# EAGLE schematic PlantController (EAGLE 6.4)

## Sheet 1 of 2
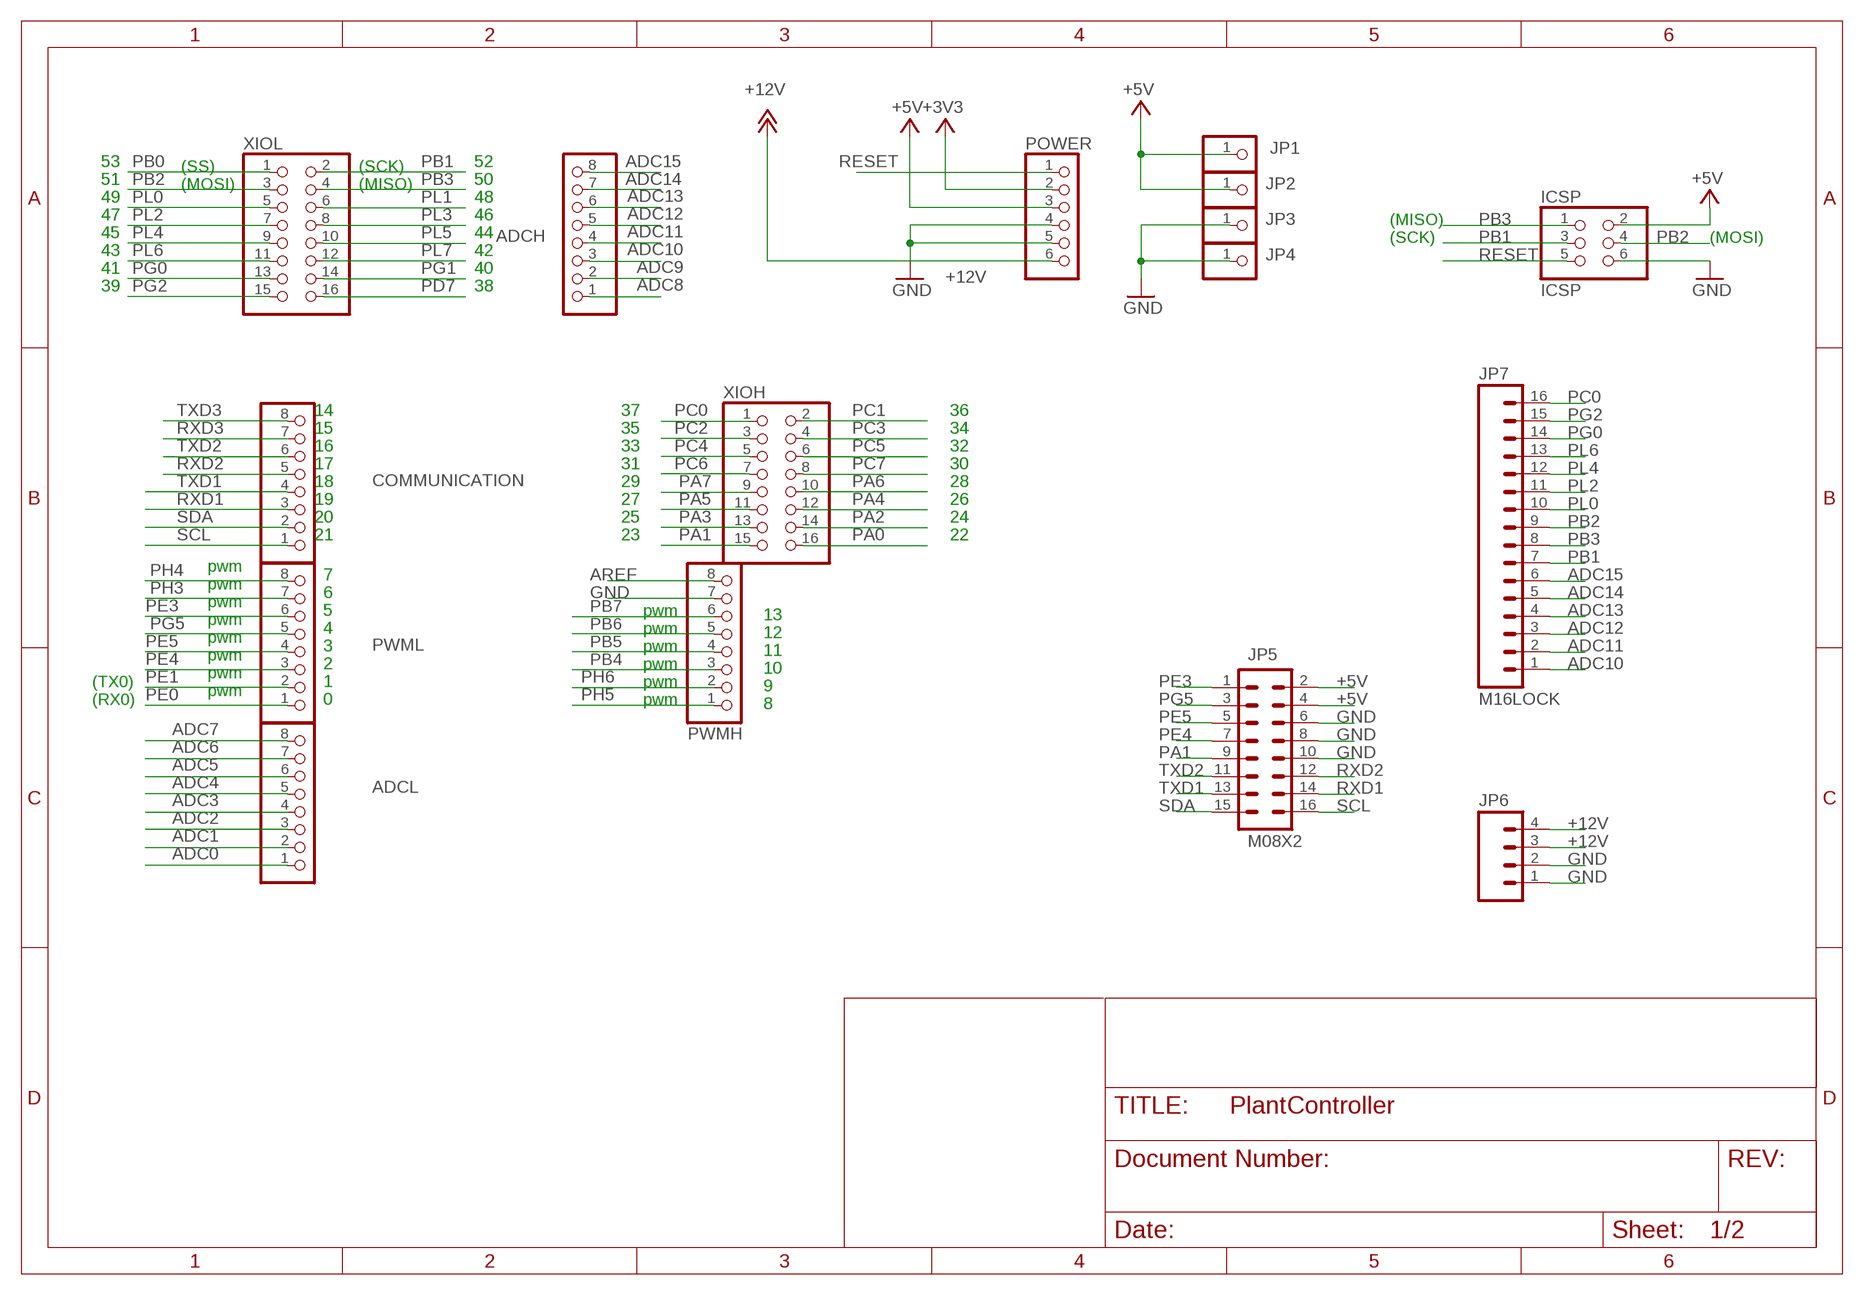
[diagram p0: schematic, sheet 1]

### Parts
ADCH  PINHD-1X8  [1X08]
ADCL  PINHD-1X8  [1X08]
COMMUNICATION  PINHD-1X8  [1X08]
ICSP  ICSP  PINHD-2X3  [2X03]
JP1  PINHD-1X1  [1X01]
JP2  PINHD-1X1  [1X01]
JP3  PINHD-1X1  [1X01]
JP4  PINHD-1X1  [1X01]
JP5  M08X2  [2X8]
JP6  M04LONGPADS  [1X04_LONGPADS]
JP7  M16LOCK  [1X16_LOCK]
POWER  PINHD-1X6  [1X06]
PWMH  PINHD-1X8  [1X08]
PWML  PINHD-1X8  [1X08]
XIOH  PINHD-2X8  [2X08]
XIOL  PINHD-2X8  [2X08]

### Nets
+3V3: POWER.2
+5V: ICSP.2 JP1.1 JP2.1 JP5.2 JP5.4 POWER.3
+12V: JP6.3 JP6.4 POWER.6 ; also sheet 2
ADC0: ADCL.1
ADC1: ADCL.2
ADC2: ADCL.3
ADC3: ADCL.4
ADC4: ADCL.5
ADC5: ADCL.6
ADC6: ADCL.7
ADC7: ADCL.8
ADC8: ADCH.1
ADC9: ADCH.2
ADC10: ADCH.3 JP7.1
ADC11: ADCH.4 JP7.2
ADC12: ADCH.5 JP7.3
ADC13: ADCH.6 JP7.4
ADC14: ADCH.7 JP7.5
ADC15: ADCH.8 JP7.6
AREF: PWMH.8
GND: ICSP.6 JP3.1 JP4.1 JP5.6 JP5.8 JP5.10 JP6.1 JP6.2 POWER.4 POWER.5 PWMH.7 ; also sheet 2
PA0: XIOH.16
PA1: JP5.9 XIOH.15
PA2: XIOH.14
PA3: XIOH.13
PA4: XIOH.12
PA5: XIOH.11
PA6: XIOH.10
PA7: XIOH.9
PB0: XIOL.1
PB1: ICSP.3 JP7.7 XIOL.2
PB2: ICSP.4 JP7.9 XIOL.3
PB3: ICSP.1 JP7.8 XIOL.4
PB4: PWMH.3
PB5: PWMH.4
PB6: PWMH.5
PB7: PWMH.6
PC0: JP7.16 XIOH.1
PC1: XIOH.2
PC2: XIOH.3
PC3: XIOH.4
PC4: XIOH.5
PC5: XIOH.6
PC6: XIOH.7
PC7: XIOH.8
PD7: XIOL.16
PE0: PWML.1
PE1: PWML.2
PE3: JP5.1 PWML.6
PE4: JP5.7 PWML.3
PE5: JP5.5 PWML.4
PG0: JP7.14 XIOL.13
PG1: XIOL.14
PG2: JP7.15 XIOL.15
PG5: JP5.3 PWML.5
PH3: PWML.7
PH4: PWML.8
PH5: PWMH.1
PH6: PWMH.2
PL0: JP7.10 XIOL.5
PL1: XIOL.6
PL2: JP7.11 XIOL.7
PL3: XIOL.8
PL4: JP7.12 XIOL.9
PL5: XIOL.10
PL6: JP7.13 XIOL.11
PL7: XIOL.12
RESET: ICSP.5 POWER.1
RXD1: COMMUNICATION.3 JP5.14
RXD2: COMMUNICATION.5 JP5.12
RXD3: COMMUNICATION.7
SCL: COMMUNICATION.1 JP5.16
SDA: COMMUNICATION.2 JP5.15
TXD1: COMMUNICATION.4 JP5.13
TXD2: COMMUNICATION.6 JP5.11
TXD3: COMMUNICATION.8

### Notes on the sheet
- 53 | (SS) | (SCK) | 52
- 51 | (MOSI) | (MISO) | 50
- 49 | 48
- 47 | 46 | (MISO)
- 45 | 44 | (SCK) | (MOSI)
- 43 | 42
- 41 | 40
- 39 | 38
- 14 | 37 | 36
- 15 | 35 | 34
- 16 | 33 | 32
- 17 | 31 | 30
- 18 | 29 | 28
- 19 | 27 | 26
- 20 | 25 | 24
- 21 | 23 | 22
- pwm
- 7
- pwm
- 6
- pwm
- 5 | pwm | 13
- pwm
- 4 | pwm | 12
- pwm
- 3 | pwm | 11
- pwm
- 2 | pwm | 10
- pwm
- (TX0) | 1 | pwm | 9
- pwm
- (RX0) | 0 | pwm | 8

## Sheet 2 of 2
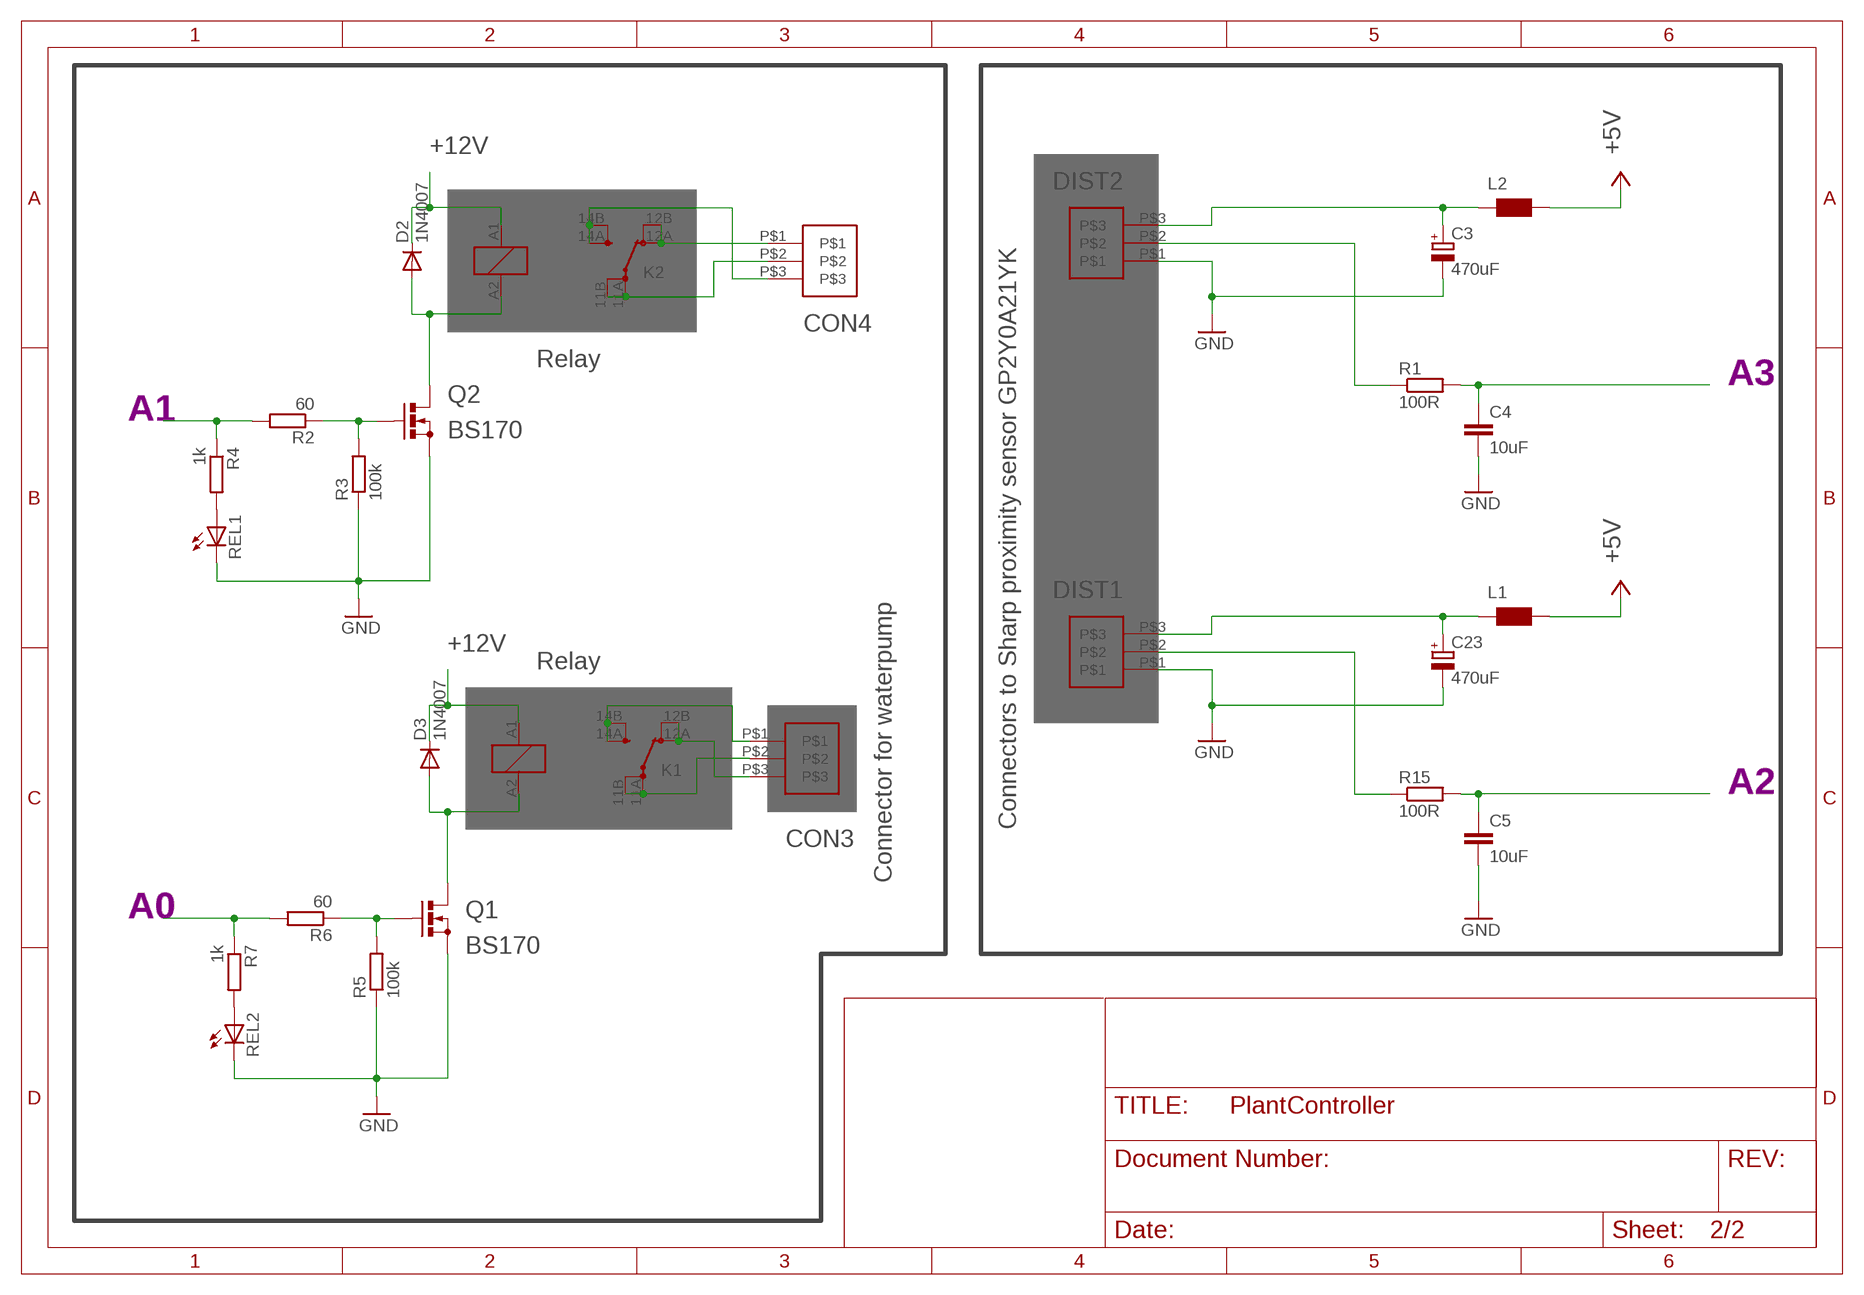
[diagram p1: schematic, sheet 2]

### Parts
C3  470uF  CPOL-EUF  [PANASONIC_F]
C4  10uF  C-EUC0805K  [C0805K]
C5  10uF  C-EUC0805K  [C0805K]
C23  470uF  CPOL-EUF  [PANASONIC_F]
CON3  IMO_20.155MV/3  [IMO_20.155MV/3]
CON4  IMO_20.155MV/3  [IMO_20.155MV/3]
D2  1N4007  1N4004  [DO41-10]
D3  1N4007  1N4004  [DO41-10]
DIST1  IMO_20.155MV/3  [IMO_20.155MV/3]
DIST2  IMO_20.155MV/3  [IMO_20.155MV/3]
K1  RT314005  [RT-C/O16A5]
K2  RT314005  [RT-C/O16A5]
L1  WE-KI_0805_B  [WE-KI_0805_B]
L2  WE-KI_0805_B  [WE-KI_0805_B]
Q1  BS170  [SOT54E]
Q2  BS170  [SOT54E]
R1  100R  R-EU_R0805  [R0805@1]
R2  60  R-EU_R0805  [R0805]
R3  100k  R-EU_R0805  [R0805]
R4  1k  R-EU_R0805  [R0805]
R5  100k  R-EU_R0805  [R0805]
R6  60  R-EU_R0805  [R0805]
R7  1k  R-EU_R0805  [R0805]
R15  100R  R-EU_R0805  [R0805@1]
REL1  LED5MM  [LED5MM]
REL2  LED5MM  [LED5MM]

### Nets
+5V_SENS: L1.1 L2.1 ; supply symbol labelled +5V
+12V: D2.C D3.C K1.A1 K2.A1 ; also sheet 1
A0: R6.2 R7.1
A1: R2.2 R4.1
A2: C5.1 R15.2
A3: C4.1 R1.2
GND: C3.- C4.2 C5.2 C23.- DIST1.P$1 DIST2.P$1 Q1.S Q2.S R3.1 R5.1 REL1.K(C) REL2.K(C) ; also sheet 1
K2: CON4.P$3 K2.14A(2:SA) K2.14B(2:SB)
N$1: D3.A K1.A2 Q1.D
N$2: Q1.G R5.2 R6.1
N$5: R7.2 REL2.A
N$9: D2.A K2.A2 Q2.D
N$17: Q2.G R2.1 R3.2
N$18: R4.2 REL1.A
N$19: CON3.P$2 K1.11A(2:PA) K1.11B(2:PB)
N$20: CON3.P$3 K1.12A(2:OA) K1.12B(2:OB)
N$21: CON3.P$1 K1.14A(2:SA) K1.14B(2:SB)
N$22: CON4.P$2 K2.11A(2:PA) K2.11B(2:PB)
N$23: CON4.P$1 K2.12A(2:OA) K2.12B(2:OB)
SENSOR_POWER: C23.+ DIST1.P$3 L1.2
SENSOR_POWER1: C3.+ DIST2.P$3 L2.2
SHARP_SENSOR: DIST1.P$2 R15.1
SHARP_SENSOR1: DIST2.P$2 R1.1

### Notes on the sheet
- Relay
- Relay
- Connectors to Sharp proximity sensor GP2Y0A21YK
- Connector for waterpump

## Library data of the parts
ADCH ADCL COMMUNICATION PWMH PWML = pinhead:PINHD-1X8: PIN HEADER
C3 C23 = resistor:CPOL-EU: POLARIZED CAPACITOR, European symbol
C4 C5 = resistor:C-EU: CAPACITOR, European symbol
CON3 CON4 DIST1 DIST2 = CONNECTORS:IMO_20.155MV/3
D2 D3 = diode:1N4004: DIODE general purpose rectifier, 1 A
ICSP = pinhead:PINHD-2X3: PIN HEADER
JP1-JP4 = pinhead:PINHD-1X1: PIN HEADER
JP5 = SparkFun:M08X2
JP6 = SparkFun:M04: Header 4 Standard 4-pin 0.1" header. Use with straight break away headers (SKU : PRT-00116), right angle break away headers (PRT-00553), swiss pins (PRT-00743), machine pins (PRT-00117), and female headers (PRT-00115). Molex polarized connector foot print use with SKU : PRT-08231 with associated crimp pins and housings. 1MM SMD Version SKU: PRT-10208
JP7 = SparkFun:M16
K1 K2 = relay:RT31*: Power PCB Relayl SCHRACK 1 pole 12 / 16 A, DC- or AC-coi Source: http://www.schrack.com/.. 5819.pdf; MPN: RT314005; OC_FARNELL: 1629043; OC_NEWARK: 03P2418
L1 L2 = wuerth-elektronik:WE-KI: SMD Wire Wound Ceramic Inductor WE-KI - Wire wound - High thermal stability - Rated current up to 1 A - High Q-factor - High SRF -- Especially developed for high frequency applications -- Perfect for applications in telecommunications -- Bluetooth -- Wireless LAN
POWER = pinhead:PINHD-1X6: PIN HEADER
Q1 Q2 = transistor-small-signal:BS170: N-CHANNEL MOS FET
R1 R15 = resistor:R-EU_: RESISTOR, European symbol
R2-R7 = rcl:R-EU_: RESISTOR, European symbol
REL1 REL2 = led:LED: LED OSRAM: - CHIPLED LG R971, LG N971, LY N971, LG Q971, LY Q971, LO R971, LY R971 LH N974, LH R974 LS Q976, LO Q976, LY Q976 LO Q996 - Hyper CHIPLED LW Q18S LB Q993, LB Q99A, LB R99A - SideLED LS A670, LO A670, LY A670, LG A670, LP A670 LB A673, LV A673, LT A673, LW A673 LH A674 LY A675 LS A676, LA A676, LO A676, LY A676, LW A676 LS A679, LY A679, LG A679 - Hyper Micro SIDELED® LS Y876, LA Y876, LO Y876, LY Y876 LT Y87S - SmartLED LW L88C, LW L88S LB L89C, LB L89S, LG L890 LS L89K, LO L89K, LY L89K LS L896, LA L896, LO L896, LY L896 - TOPLED LS T670, LO T670, LY T670, LG T670, LP T670 LSG T670, LSP T670, LSY T670, LOP T670, LYG T670 LG T671, LOG T671, LSG T671 LB T673, LV T673, LT T673, LW T673 LH T674 LS T676, LA T676, LO T676, LY T676, LB T676, LH T676, LSB T676, LW T676 LB T67C, LV T67C, LT T67C, LS T67K, LO T67K, LY T67K, LW E67C LS E67B, LA E67B, LO E67B, LY E67B, LB E67C, LV E67C, LT E67C LW T67C LS T679, LY T679, LG T679 LS T770, LO T770, LY T770, LG T770, LP T770 LB T773, LV T773, LT T773, LW T773 LH T774 LS E675, LA E675, LY E675, LS T675 LS T776, LA T776, LO T776, LY T776, LB T776 LHGB T686 LT T68C, LB T68C - Hyper Mini TOPLED® LB M676 - Mini TOPLED Santana® LG M470 LS M47K, LO M47K, LY M47K Source: http://www.osram.convergy.de LUXEON: - LUMILED® LXK2-PW12-R00, LXK2-PW12-S00, LXK2-PW14-U00, LXK2-PW14-V00 LXK2-PM12-R00, LXK2-PM12-S00, LXK2-PM14-U00 LXK2-PE12-Q00, LXK2-PE12-R00, LXK2-PE12-S00, LXK2-PE14-T00, LXK2-PE14-U00 LXK2-PB12-K00, LXK2-PB12-L00, LXK2-PB12-M00, LXK2-PB14-N00, LXK2-PB14-P00, LXK2-PB14-Q00 LXK2-PR12-L00, LXK2-PR12-M00, LXK2-PR14-Q00, LXK2-PR14-R00 LXK2-PD12-Q00, LXK2-PD12-R00, LXK2-PD12-S00 LXK2-PH12-R00, LXK2-PH12-S00 LXK2-PL12-P00, LXK2-PL12-Q00, LXK2-PL12-R00 Source: www.luxeon.com KINGBRIGHT: KA-3528ASYC Source: www.kingbright.com
XIOH XIOL = pinhead:PINHD-2X8: PIN HEADER